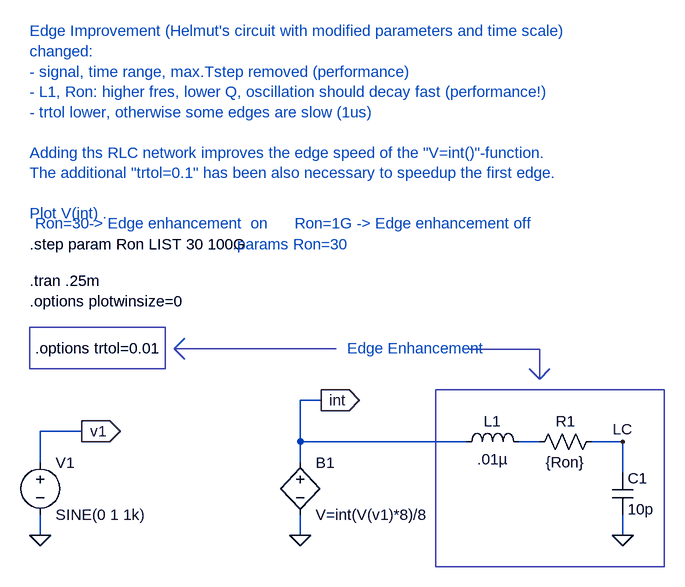
[diagram p0: schematic Edge_enhancement2.asc]
Edge_enhancement2.asc, the LTspice schematic file:
Version 4
SHEET 1 980 680
WIRE -112 144 -112 96
WIRE -112 256 -112 224
WIRE -48 96 -112 96
WIRE 288 112 288 48
WIRE 288 144 288 112
WIRE 288 256 288 224
WIRE 320 48 288 48
WIRE 544 112 288 112
WIRE 656 112 624 112
WIRE 784 112 736 112
WIRE 784 160 784 112
WIRE 784 256 784 224
FLAG 288 256 0
FLAG -112 256 0
FLAG -48 96 v1
IOPIN -48 96 Out
FLAG 320 48 int
IOPIN 320 48 Out
FLAG 784 256 0
FLAG 784 112 LC
SYMBOL voltage -112 128 R0
WINDOW 123 0 0 Left 0
WINDOW 39 0 0 Left 0
SYMATTR InstName V1
SYMATTR Value SINE(0 1 1k)
SYMBOL bv 288 128 R0
SYMATTR InstName B1
SYMATTR Value V=int(V(v1)*8)/8
SYMBOL cap 768 160 R0
SYMATTR InstName C1
SYMATTR Value 10p
SYMBOL res 640 128 R270
WINDOW 0 32 56 VTop 0
WINDOW 3 0 56 VBottom 0
SYMATTR InstName R1
SYMATTR Value {Ron}
SYMBOL ind 528 128 R270
WINDOW 0 32 56 VTop 0
WINDOW 3 5 56 VBottom 0
SYMATTR InstName L1
SYMATTR Value .01µ
TEXT -128 -136 Left 0 !.tran .25m
TEXT -128 -104 Left 0 !.options plotwinsize=0
TEXT -120 -32 Left 0 !.options trtol=0.01
TEXT -128 -192 Left 0 !.step param Ron LIST 30 100G
TEXT -128 -520 Left 0 ;Edge Improvement (Helmut's circuit with modified parameters and time scale)\nchanged:\n- signal, time range, max.Tstep removed (performance)\n- L1, Ron: higher fres, lower Q, oscillation should decay fast (performance!)\n- trtol lower, otherwise some edges are slow (1us)\n \nAdding ths RLC network improves the edge speed of the "V=int()"-function.\nThe additional "trtol=0.1" has been also necessary to speedup the first edge.\n \nPlot V(int) .
TEXT 360 -32 Left 0 ;Edge Enhancement
TEXT -120 -224 Left 0 ;Ron=30-> Edge enhancement  on      Ron=1G -> Edge enhancement off
TEXT 184 -192 Left 0 ;.params Ron=30
LINE Normal 656 -30 548 -30
LINE Normal 656 16 656 -30
LINE Normal 672 0 656 16
LINE Normal 640 0 656 16
LINE Normal 94 -31 343 -31
LINE Normal 110 -47 94 -31
LINE Normal 110 -15 94 -31
RECTANGLE Normal 848 304 496 32
RECTANGLE Normal 80 0 -128 -64

The netlist it stands for:
* Edge_enhancement2.asc
V1 v1 0 SINE(0 1 1k)
B1 int 0 V=int(V(v1)*8)/8
C1 LC 0 10p
R1 N001 LC {Ron}
L1 int N001 .01µ
.tran .25m
.options plotwinsize=0
.options trtol=0.01
.step param Ron LIST 30 100G
* Edge Improvement (Helmut's circuit with modified parameters and time scale)
* changed:
* - signal, time range, max.Tstep removed (performance)
* - L1, Ron: higher fres, lower Q, oscillation should decay fast (performance!)
* - trtol lower, otherwise some edges are slow (1us)
* Adding ths RLC network improves the edge speed of the "V=int()"-function.
* The additional "trtol=0.1" has been also necessary to speedup the first edge.
* Plot V(int) .
* Edge Enhancement
* Ron=30-> Edge enhancement  on      Ron=1G -> Edge enhancement off
* .params Ron=30
.backanno
.end